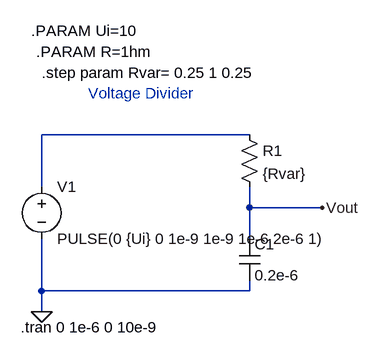
[diagram p0: schematic Draft6.asc]
Draft6.asc, the LTspice schematic file:
Version 4
SHEET 1 880 680
WIRE 320 80 0 80
WIRE 0 160 0 80
WIRE 320 192 320 160
WIRE 432 192 320 192
WIRE 320 240 320 192
WIRE 0 320 0 240
WIRE 320 320 320 304
WIRE 320 320 0 320
WIRE 0 352 0 320
FLAG 0 352 0
FLAG 432 192 Vout
SYMBOL res 304 64 R0
SYMATTR InstName R1
SYMATTR Value {Rvar}
SYMBOL voltage 0 144 R0
WINDOW 123 0 0 Left 0
WINDOW 39 0 0 Left 0
SYMATTR InstName V1
SYMATTR Value PULSE(0 {Ui} 0 1e-9 1e-9 1e-6 2e-6 1)
SYMBOL cap 304 240 R0
SYMATTR InstName C1
SYMATTR Value 0.2e-6
TEXT -32 376 Left 2 !.tran 0 1e-6 0 10e-9
TEXT 72 16 Left 2 ;Voltage Divider
TEXT -16 -80 Left 2 !.PARAM Ui=10
TEXT -8 -48 Left 2 !.PARAM R=1hm
TEXT 0 -16 Left 2 !.step param Rvar= 0.25 1 0.25

The netlist it stands for:
* Draft6.asc
R1 N001 Vout {Rvar}
V1 N001 0 PULSE(0 {Ui} 0 1e-9 1e-9 1e-6 2e-6 1)
C1 Vout 0 0.2e-6
.tran 0 1e-6 0 10e-9
* Voltage Divider
.PARAM Ui=10
.PARAM R=1hm
.step param Rvar= 0.25 1 0.25
.backanno
.end